# Altium schematic sheet ADCS.SchDoc
size A; SPICEModelCacheWDEDLVVZ: <root> / <DocumentId>WDEDLVVZ</DocumentId> / </root>
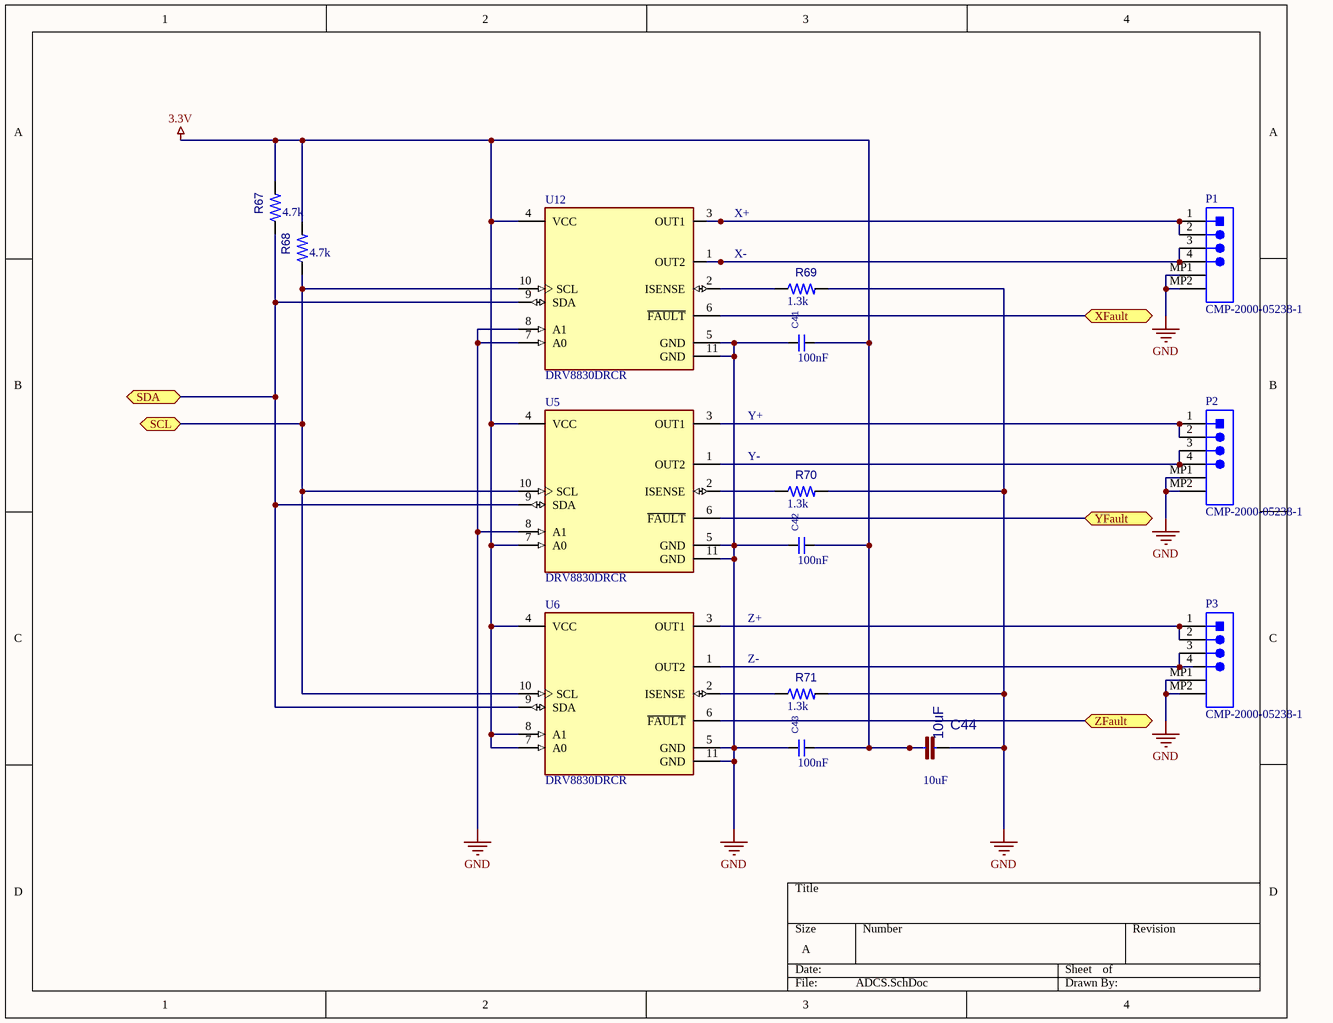
[diagram p0: ADCS.SchDoc]

## Parts
C41  100nF  [Resistor_0805]
C42  100nF  [Resistor_0805]
C43  100nF  [Resistor_0805]
C44  10uF  [C_0603_1608Metric]
P1  CMP-2000-05238-1  [MOLEX-53261-0471_V]
P2  CMP-2000-05238-1  [MOLEX-53261-0471_V]
P3  CMP-2000-05238-1  [MOLEX-53261-0471_V]
R67  4.7k  [L_0805_2012Metric_Pad1.15x1.40mm_HandSolder]
R68  4.7k  [L_0805_2012Metric_Pad1.15x1.40mm_HandSolder]
R69  1.3k  [L_0805_2012Metric_Pad1.15x1.40mm_HandSolder]
R70  1.3k  [L_0805_2012Metric_Pad1.15x1.40mm_HandSolder]
R71  1.3k  [L_0805_2012Metric_Pad1.15x1.40mm_HandSolder]
U5  DRV8830DRCR  [FP-DRC0010J-MFG]
U6  DRV8830DRCR  [FP-DRC0010J-MFG]
U12  DRV8830DRCR  [FP-DRC0010J-MFG]

## Ports
SCL (bidir), SDA (bidir), XFault (bidir), YFault (bidir), ZFault (bidir)

## Nets
3.3V: C41.2 C42.2 C43.2 C44.1 R67.2 R68.2 U5.4(VCC) U5.7(A0) U6.4(VCC) U6.7(A0) U6.8(A1) U12.4(VCC)
GND: C41.1 C42.1 C43.1 C44.2 P1.MP1 P1.MP2 P2.MP1 P2.MP2 P3.MP1 P3.MP2 R69.2 R70.2 R71.2 U5.5(GND) U5.8(A1) U5.11(GND) U6.5(GND) U6.11(GND) U12.5(GND) U12.7(A0) U12.8(A1) U12.11(GND)
SCL: R68.1 U5.10(SCL) U6.10(SCL) U12.10(SCL) ; port SCL
SDA: R67.1 U5.9(SDA) U6.9(SDA) U12.9(SDA) ; port SDA
XFault: U12.6(~{FAULT}) ; port XFault
YFault: U5.6(~{FAULT}) ; port YFault
ZFault: U6.6(~{FAULT}) ; port ZFault
NetP1_1: P1.1 P1.2 U12.3(OUT1)
NetP1_3: P1.3 P1.4 U12.1(OUT2)
NetP2_1: P2.1 P2.2 U5.3(OUT1)
NetP2_3: P2.3 P2.4 U5.1(OUT2)
NetP3_1: P3.1 P3.2 U6.3(OUT1)
NetP3_3: P3.3 P3.4 U6.1(OUT2)
NetR69_1: R69.1 U12.2(ISENSE)
NetR70_1: R70.1 U5.2(ISENSE)
NetR71_1: R71.1 U6.2(ISENSE)

## Notes on the sheet
- (near U12) X+
- X-
- Y+
- Y-
- Z+
- Z-

## Library data of the parts
C41-C43 = CL21B104KBCNNNC: MPN: CL21B104KBCNNNC
C44 = 1210ZC106KAT2A: Footprint: Capacitor_SMD:C_0603_1608Metric; MPN: 1210ZC106KAT2A; Value: 10uF
P1-P3 = CMP-2000-05238-1: Male Header, Pitch 1.25 mm, 1 x 4 Position, Height 3.4 mm, -40 to 85 degC, RoHS, Tape and Reel; MPN: 0533984004; Supplier 1: Digi-Key
R67 R68 = RC0805FR-074K7L: MPN: RC0805FR-074K7L
R69-R71 = ERJ-6ENF1301V: MPN: ERJ-6ENF1301V
U5 U6 U12 = CMP-04915-000001-1: IC MTRDRV BIPLR 2.75-6.8V 10VSON; Manufacturer: Texas Instruments; Switching Frequency: 44.5kHz; Standoff Height: 0mm; Nominal Supply Current: 1.4mA; Max Junction Temp: +150°C; Number Of Outputs: 1; Min Supply Voltage: 2.75V; Motor Type: Brushed; Max Supply Voltage: 6.8V; Output Current: 1A; Automotive: No; Temperature: -40°C to +85°C; ComponentLink2Description: Datasheet; Package: DRC0010J; Octopart: https://octopart.com/drv8830drcr-texas+instruments-21221812; Device Class L3: Motor Drivers; Height: 1mm; Lead Free: Yes; Device Class L2: Power Management ICs; Mouser Description: 1A Low Voltage Brushed DC Motor Driver with Speed Regulation (I2C Ctrl) 10-VSON -40 to 85; MPN: DRV8830DRCR; Temperature Range High: +85°C; ComponentLink2URL: http://www.ti.com/lit/ds/symlink/drv8830.pdf; Category: IC; RoHS: TRUE; Device Class L1: Integrated Circuits (ICs); Digikey Description: IC MTRDRV BIPLR 2.75-6.8V 10VSON; Temperature Range Low: -40°C